# EAGLE design MainBoard (EAGLE 8.3.1)
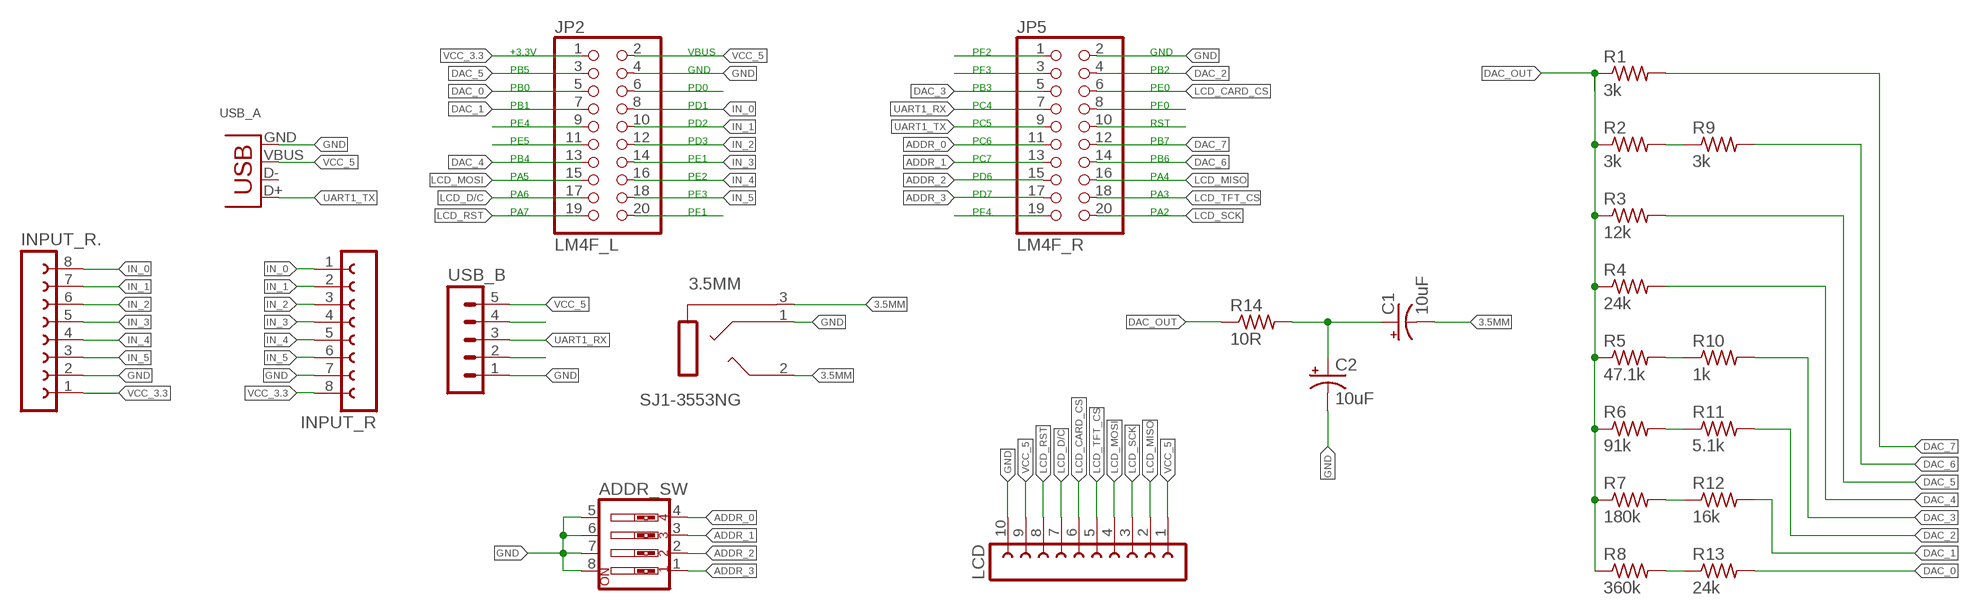
[diagram p0: schematic, sheet 1]

## Parts
3.5MM  SJ1-3553NG  [SJ1-3553NG]
ADDR_SW  SW_DIP-4  [EDG-04]
C1  10uF  CPOL-USE2-4  [E2-4]
C2  10uF  CPOL-USE2-4  [E2-4]
INPUT_R  FE08W  [FE08W]
INPUT_R.  FE08W  [FE08W]
JP2  LM4F_L  PINHD-2X10  [2X10]
JP5  LM4F_R  PINHD-2X10  [2X10]
LCD  FE10-1  [FE10]
R1  3k  R-US_0309/10  [0309/10]
R2  3k  R-US_0309/10  [0309/10]
R3  12k  R-US_0309/10  [0309/10]
R4  24k  R-US_0309/10  [0309/10]
R5  47.1k  R-US_0309/10  [0309/10]
R6  91k  R-US_0309/10  [0309/10]
R7  180k  R-US_0309/10  [0309/10]
R8  360k  R-US_0309/10  [0309/10]
R9  3k  R-US_0309/10  [0309/10]
R10  1k  R-US_0309/10  [0309/10]
R11  5.1k  R-US_0309/10  [0309/10]
R12  16k  R-US_0309/10  [0309/10]
R13  24k  R-US_0309/10  [0309/10]
R14  10R  R-US_0309/10  [0309/10]
USB_A  USB-A-H  [USB-A-H]
USB_B  MA05-1  [MA05-1]

## Nets
3.5MM: 3.5MM.2(TIP) 3.5MM.3(SLEEVE) C1.-
ADDR_0: ADDR_SW.4 JP5.11
ADDR_1: ADDR_SW.3 JP5.13
ADDR_2: ADDR_SW.2 JP5.15
ADDR_3: ADDR_SW.1 JP5.17
DAC_0: JP2.5 R13.2
DAC_1: JP2.7 R12.2
DAC_2: JP5.4 R11.2
DAC_3: JP5.5 R10.2
DAC_4: JP2.13 R4.2
DAC_5: JP2.3 R3.2
DAC_6: JP5.14 R9.2
DAC_7: JP5.12 R1.2
DAC_OUT: R1.1 R2.1 R3.1 R4.1 R5.1 R6.1 R7.1 R8.1 R14.1
GND: 3.5MM.1(RING) ADDR_SW.5 ADDR_SW.6 ADDR_SW.7 ADDR_SW.8 C2.- INPUT_R.7 INPUT_R..2 JP2.4 JP5.2 LCD.10 USB_A.GND USB_B.1
IN_0: INPUT_R.1 INPUT_R..8 JP2.8
IN_1: INPUT_R.2 INPUT_R..7 JP2.10
IN_2: INPUT_R.3 INPUT_R..6 JP2.12
IN_3: INPUT_R.4 INPUT_R..5 JP2.14
IN_4: INPUT_R.5 INPUT_R..4 JP2.16
IN_5: INPUT_R.6 INPUT_R..3 JP2.18
LCD_CARD_CS: JP5.6 LCD.6
LCD_D/C: JP2.17 LCD.7
LCD_MISO: JP5.16 LCD.2
LCD_MOSI: JP2.15 LCD.4
LCD_RST: JP2.19 LCD.8
LCD_SCK: JP5.20 LCD.3
LCD_TFT_CS: JP5.18 LCD.5
N$1: C1.+ C2.+ R14.2
N$2: R7.2 R12.1
N$3: R8.2 R13.1
N$5: R2.2 R9.1
N$6: R5.2 R10.1
N$7: R6.2 R11.1
N$11: USB_B.2
N$13: USB_B.4
PD0: JP2.6
PE4: JP2.9
PE5: JP2.11
PF0: JP5.8
PF1: JP2.20
PF2: JP5.1
PF3: JP5.3
PF4: JP5.19
RST: JP5.10
UART1_RX: JP5.7 USB_B.3
UART1_TX: JP5.9 USB_A.D+
VCC_3.3: INPUT_R.8 INPUT_R..1 JP2.1
VCC_5: JP2.2 LCD.1 LCD.9 USB_A.VBUS USB_B.5
Unconnected: USB_A.D-

## Notes on the sheet
- +3.3V | VBUS | PF2 | GND
- PB5 | GND | PF3 | PB2
- PB0 | PD0 | PB3 | PE0
- PB1 | PD1 | PC4 | PF0
- PE4 | PD2 | PC5 | RST
- PE5 | PD3 | PC6 | PB7
- PB4 | PE1 | PC7 | PB6
- PA5 | PE2 | PD6 | PA4
- PA6 | PE3 | PD7 | PA3
- PA7 | PF1 | PF4 | PA2

## Library data of the parts
3.5MM = SJ1-3553NG:SJ1-3553NG: STEREO JACK - 3.5mm; DESCRIPTION: SJ1 Series 3.5 mm 12 V Right Angle Through Hole Isolated Stereo Audio Jack; DIGI-KEY_PART_NUMBER: CP1-3553NG-ND; DIGI-KEY_PURCHASE_URL: https://www.digikey.com/product-detail/en/cui-inc/SJ1-3553NG/CP1-3553NG-ND/738710?WT.z_cid=ref_snapeda&utm_source=snapeda&utm_medium=aggregator&utm_campaign=buynow; MF: CUI; MP: SJ1-3553NG; PACKAGE: None
ADDR_SW = special:SW_DIP-4: DIP SWITCH
C1 C2 = rcl:CPOL-US: POLARIZED CAPACITOR, American symbol; SPICEPREFIX: C
INPUT_R INPUT_R. = con-lsta:FE08W: FEMALE HEADER; OC_FARNELL: unknown; OC_NEWARK: unknown
JP2 JP5 = pinhead:PINHD-2X10: PIN HEADER
LCD = con-lsta:FE10-1: FEMALE HEADER; OC_FARNELL: unknown; OC_NEWARK: unknown
R1-R14 = rcl:R-US_: RESISTOR, American symbol
USB_A = con-usb-3:USB: USB Connectors
USB_B = con-lstb:MA05-1: PIN HEADER; OC_FARNELL: unknown; OC_NEWARK: unknown

## Net classes
1 Power: width 0.508 mm, clearance 0.381 mm

## Board
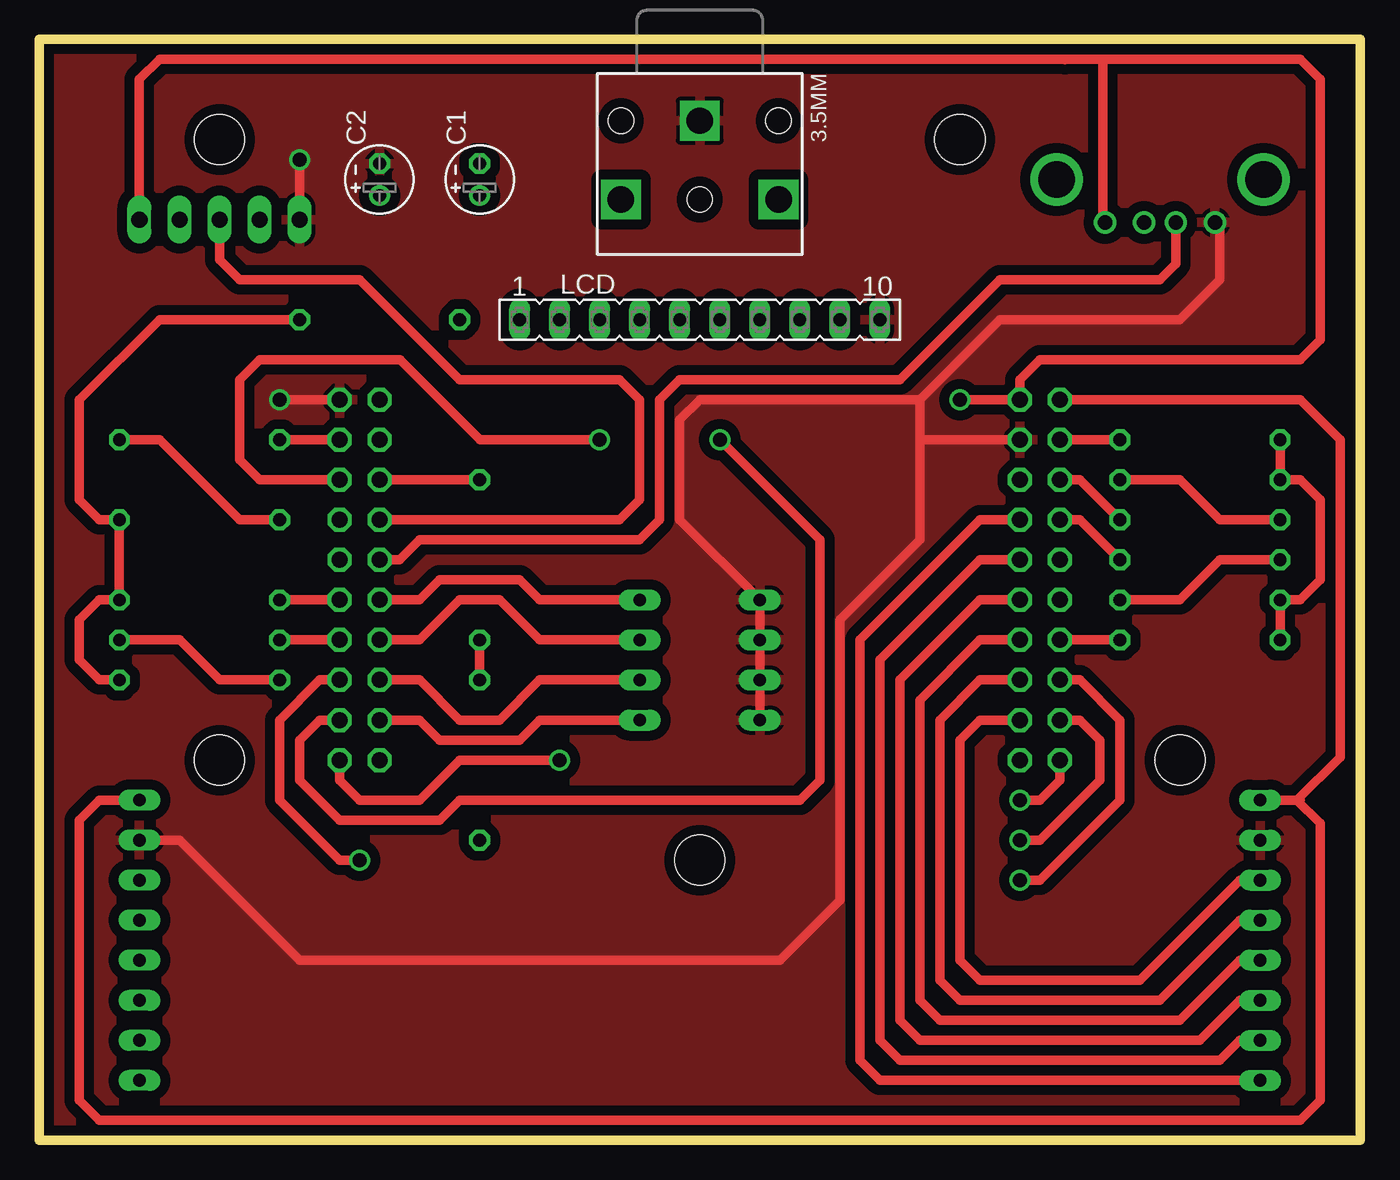
[diagram p1: board, top side]
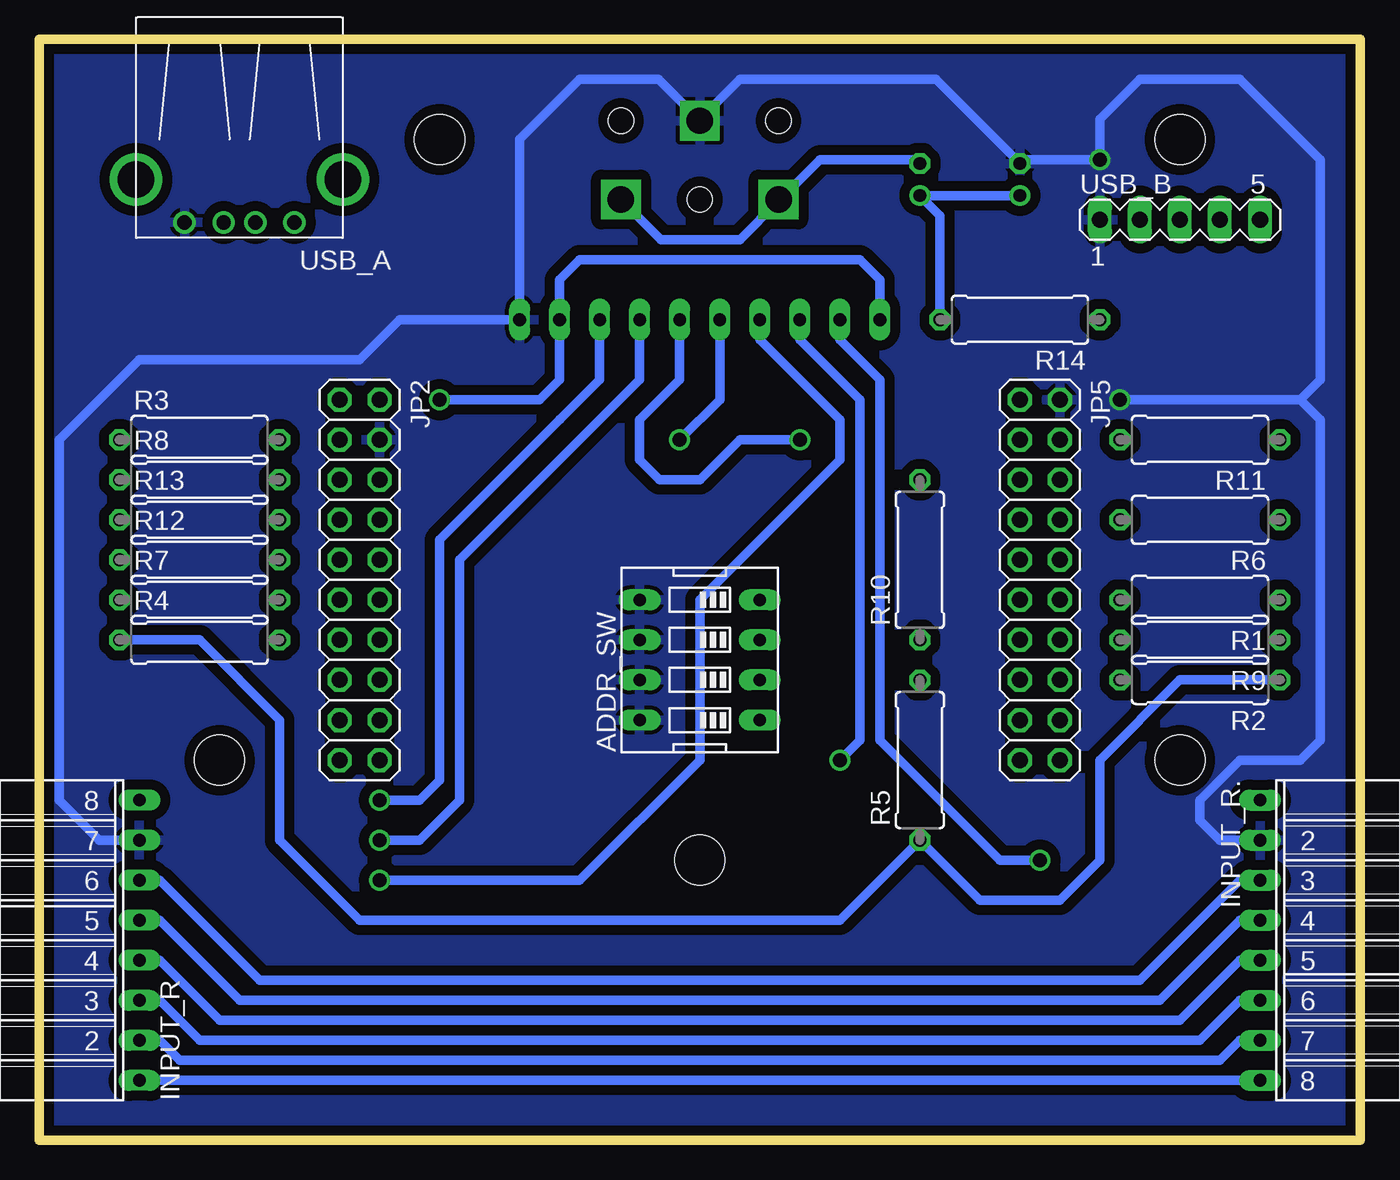
[diagram p2: board, bottom side, seen from below]

Size 83.82 x 69.85 mm. Coordinates in mm from the lower left corner, seen from the top.
Outline: 0,0 83.82,0 83.82,69.85 0,69.85 0,0
Copper layers (1*16): Top 0.035mm / dielectric 1.5mm / Bottom 0.035mm
Design rules "default *": minimum track width 6mil, minimum drill 0.35mm, track to track 10mil, track to pad 12mil, pad to pad 6mil, via to via 15mil, smd to smd 6mil, copper to edge 10mil, drill to drill 10mil, minimum pad ring 10mil, minimum via ring 8mil, stop-mask expansion 4mil, vias tented up to drill 0mil, thermal gap 10mil
Holes 3.17 mm at 11.43,63.5 58.42,63.5 72.39,24.13 41.91,17.78 11.43,24.13

### Footprints (pad centres in the part's own frame; a part is rotated, then mirrored left to right if it is on the bottom)
SJ1-3553NG = drill 1.676 square: 1 -5,0; 2 0,-5; 3 0,5 | hole 1.6: -5,-5; -5,5; 0,0
EDG-04 = drill 0.813 long: 1 -3.81,-3.81; 2 -1.27,-3.81; 3 1.27,-3.81; 4 3.81,-3.81; 5 3.81,3.81; 6 1.27,3.81; 7 -1.27,3.81; 8 -3.81,3.81
E2-4 = drill 0.813 pad 1.27: + -1.016,0 | drill 0.813 pad 1.27 octagon: - 1.016,0
FE08W = drill 0.813 long: 1 -8.89,0; 2 -6.35,0; 3 -3.81,0; 4 -1.27,0; 5 1.27,0; 6 3.81,0; 7 6.35,0; 8 8.89,0
2X10 = drill 1.016 octagon: 1 -11.43,-1.27; 2 -11.43,1.27; 3 -8.89,-1.27; 4 -8.89,1.27; 5 -6.35,-1.27; 6 -6.35,1.27; 7 -3.81,-1.27; 8 -3.81,1.27; 9 -1.27,-1.27; 10 -1.27,1.27; 11 1.27,-1.27; 12 1.27,1.27; 13 3.81,-1.27; 14 3.81,1.27; 15 6.35,-1.27; 16 6.35,1.27; 17 8.89,-1.27; 18 8.89,1.27; 19 11.43,-1.27; 20 11.43,1.27
FE10 = drill 0.813 long: 1 -11.43,0; 2 -8.89,0; 3 -6.35,0; 4 -3.81,0; 5 -1.27,0; 6 1.27,0; 7 3.81,0; 8 6.35,0; 9 8.89,0; 10 11.43,0
0309/10 = drill 0.813 octagon: 1 -5.08,0; 2 5.08,0
USB-A-H = drill 0.914: D+ 2.718,-1.003; D- 2.718,1.003; GND 2.718,-3.493; VBUS 2.718,3.493 | drill 2.311: P$5 0,-6.566; P$6 0,6.566
MA05-1 = drill 1.016 long: 1 -5.08,0; 2 -2.54,0; 3 0,0; 4 2.54,0; 5 5.08,0

### Placement (x,y rotation side)
3.5MM  41.91,59.69 270 top
ADDR_SW  41.91,30.48 90 bottom
C1  27.94,60.96 90 top
C2  21.59,60.96 90 top
INPUT_R  77.47,12.7 90 bottom
INPUT_R.  6.35,12.7 270 bottom
JP2  63.5,35.56 270 bottom
JP5  20.32,35.56 270 bottom
LCD  41.91,52.07 0 top
R1  10.16,34.29 180 bottom
R2  10.16,29.21 180 bottom
R3  73.66,44.45 0 bottom
R4  73.66,31.75 0 bottom
R5  27.94,24.13 90 bottom
R6  10.16,39.37 180 bottom
R7  73.66,34.29 0 bottom
R8  73.66,41.91 0 bottom
R9  10.16,31.75 180 bottom
R10  27.94,36.83 90 bottom
R11  10.16,44.45 180 bottom
R12  73.66,36.83 0 bottom
R13  73.66,39.37 0 bottom
R14  21.59,52.07 180 bottom
USB_A  71.12,60.96 270 bottom
USB_B  11.43,58.42 0 bottom

### Tracks (layer width: path | path; a pad name or v marks a point on that pad's centre or on a via)
3.5MM
  Bottom 0.61: 3.5MM.3 44.37,57.15 39.37,57.15 36.91,59.61 3.5MM.2 36.83,59.69 34.29,62.23 28.19,62.23 C1.-
ADDR_0
  Top 0.61: JP5.11 24.13,34.29 25.4,35.56 30.48,35.56 31.75,34.29 ADDR_SW.4
ADDR_1
  Top 0.61: JP5.13 24.13,31.75 26.67,34.29 29.21,34.29 31.75,31.75 ADDR_SW.3
ADDR_2
  Top 0.61: ADDR_SW.2 34.34,29.21 34.29,29.21 31.75,29.21 29.21,26.67 26.67,26.67 24.13,29.21 JP5.15
ADDR_3
  Top 0.61: 22.86,26.67 JP5.17 24.13,26.67 25.4,25.4 30.48,25.4 31.75,26.67 ADDR_SW.1
DAC_0
  Top 0.61: JP2.5 66.04,41.91 R13.2
DAC_1
  Top 0.61: R12.2 66.04,39.37 JP2.7
DAC_2
  Top 0.61: R11.2 JP5.4
DAC_3
  Top 0.61: JP5.5 R10.2
DAC_4
  Top 0.61: R4.2 JP2.13
DAC_5
  Top 0.61: JP2.3 R3.2
DAC_6
  Top 0.61: R9.2 JP5.14
DAC_7
  Top 0.61: R1.2 JP5.12
DAC_OUT
  Top 0.61: R2.1 3.81,29.21 2.54,30.48 2.54,33.02 3.81,34.29 R1.1 R6.1 3.81,39.37 2.54,40.64 2.54,46.99 7.62,52.07 R14.1 | R3.1 R8.1 80.01,41.91 81.28,40.64 81.28,35.56 80.01,34.29 R7.1 R4.1
  Bottom 0.61: R2.1 11.43,29.21 16.51,24.13 16.51,17.78 19.05,15.24 24.13,15.24 R5.1 33.02,13.97 63.5,13.97 68.58,19.05 68.58,26.67 73.66,31.75 R4.1
GND  (via drill 0.89)
  Top 0.61: INPUT_R..2 8.89,19.05 16.51,11.43 46.99,11.43 50.8,15.24 50.8,33.02 55.88,38.1 55.88,44.45 | 55.88,46.99 55.88,44.45 | ADDR_SW.8 ADDR_SW.7 ADDR_SW.6 ADDR_SW.5 40.64,39.37 40.64,45.72 41.91,46.99 55.88,46.99 | USB_A.GND 74.93,57.92 74.93,54.61 72.39,52.07 60.96,52.07 55.88,46.99 | USB_B.1 v16.51,62.23 | JP5.2 v15.24,46.99 | JP2.4 55.88,44.45
  Bottom 0.61: INPUT_R.7 80.01,19.05 82.55,21.59 82.55,44.45 77.47,49.53 63.5,49.53 60.96,52.07 LCD.10 53.34,63.5 49.53,67.31 44.53,67.31 3.5MM.1 41.91,64.77 39.37,67.31 26.92,67.31 21.79,62.18 | 21.79,62.18 C2.- 21.34,62.23 | 21.34,62.23 21.74,62.23 21.79,62.18 | 21.34,62.23 v16.51,62.23 16.51,64.77 13.97,67.31 7.62,67.31 2.54,62.23 2.54,48.26 3.81,46.99 | 3.81,46.99 v15.24,46.99 | INPUT_R..2 8.89,19.05 10.16,20.32 10.16,21.59 7.62,24.13 3.81,24.13 2.54,25.4 2.54,45.72 3.81,46.99
  pour Top (isolate 0.635): 0,0 83.82,0 83.82,69.85 0,69.85
  pour Bottom (isolate 0.635): 0,69.85 0,0 83.82,0 83.82,69.85
IN_0
  Top 0.61: INPUT_R.1 53.34,3.81 52.07,5.08 52.07,31.75 59.69,39.37 JP2.8
  Bottom 0.61: INPUT_R..8 INPUT_R.1
IN_1
  Top 0.61: JP2.10 59.69,36.83 53.34,30.48 53.34,6.35 54.61,5.08 74.93,5.08 76.2,6.35 INPUT_R.2
  Bottom 0.61: INPUT_R.2 76.2,6.35 74.93,5.08 8.89,5.08 7.62,6.35 INPUT_R..7
IN_2
  Top 0.61: INPUT_R.3 76.2,8.89 73.66,6.35 55.88,6.35 54.61,7.62 54.61,29.21 59.69,34.29 JP2.12
  Bottom 0.61: INPUT_R..6 7.62,8.89 10.16,6.35 73.66,6.35 76.2,8.89 INPUT_R.3
IN_3
  Top 0.61: JP2.14 59.69,31.75 55.88,27.94 55.88,8.89 57.15,7.62 72.39,7.62 76.2,11.43 INPUT_R.4
  Bottom 0.61: INPUT_R.4 76.2,11.43 72.39,7.62 11.43,7.62 7.62,11.43 INPUT_R..5
IN_4
  Top 0.61: INPUT_R.5 76.2,13.97 71.12,8.89 58.42,8.89 57.15,10.16 57.15,26.67 59.69,29.21 JP2.16
  Bottom 0.61: INPUT_R..4 7.62,13.97 12.7,8.89 71.12,8.89 76.2,13.97 INPUT_R.5
IN_5
  Top 0.61: JP2.18 59.69,26.67 58.42,25.4 58.42,11.43 59.69,10.16 69.85,10.16 76.2,16.51 INPUT_R.6
  Bottom 0.61: INPUT_R.6 76.2,16.51 69.85,10.16 13.97,10.16 7.62,16.51 INPUT_R..3
LCD_CARD_CS  (via drill 0.89)
  Top 0.61: JP5.6 13.97,41.91 12.7,43.18 12.7,48.26 13.97,49.53 22.89,49.53 27.97,44.45 v35.56,44.45
  Bottom 0.61: v35.56,44.45 39.37,44.45 41.91,41.91 44.45,41.91 45.72,43.18 45.72,45.72 43.18,48.26 LCD.6
LCD_D/C  (via drill 0.89)
  Top 0.61: JP2.17 66.04,26.67 67.31,25.4 67.31,22.86 63.5,19.05 v62.23,19.05
  Bottom 0.61: v62.23,19.05 59.69,19.05 57.15,21.59 57.15,36.83 45.72,48.26 LCD.7
LCD_MISO  (via drill 0.89)
  Top 0.61: JP5.16 17.78,29.21 15.24,26.67 15.24,21.59 19.05,17.78 v20.32,17.78
  Bottom 0.61: v20.32,17.78 22.86,17.78 30.48,25.4 30.48,48.26 33.02,50.8 LCD.2
LCD_MOSI  (via drill 0.89)
  Top 0.61: JP2.15 66.04,29.21 68.58,26.67 68.58,21.59 63.5,16.51 v62.23,16.51
  Bottom 0.61: LCD.4 38.1,50.8 33.02,45.72 33.02,43.18 41.91,34.29 41.91,24.13 49.53,16.51 v62.23,16.51
LCD_RST  (via drill 0.89)
  Top 0.61: JP2.19 64.77,22.86 63.5,21.59 v62.23,21.59
  Bottom 0.61: v62.23,21.59 59.69,21.59 58.42,22.86 58.42,38.1 50.77,45.75 | LCD.8 48.26,48.26 50.77,45.75 | 50.77,45.75 50.8,45.72
LCD_SCK  (via drill 0.89)
  Top 0.61: JP5.20 19.05,22.86 20.32,21.59 24.13,21.59 26.67,24.13 v33.02,24.13
  Bottom 0.61: LCD.3 35.56,50.8 31.75,46.99 31.75,25.4 v33.02,24.13
LCD_TFT_CS  (via drill 0.89)
  Top 0.61: JP5.18 17.78,26.67 16.51,25.4 16.51,22.86 19.05,20.32 25.4,20.32 26.67,21.59 48.26,21.59 49.53,22.86 49.53,38.1 v43.18,44.45
  Bottom 0.61: LCD.5 40.64,46.99 v43.18,44.45
N$1
  Bottom 0.61: R14.2 26.67,58.67 C1.+ C2.+
N$2
  Top 0.61: R7.2 72.39,34.29 74.93,36.83 R12.1
N$3
  Top 0.61: R8.2 72.39,41.91 74.93,39.37 R13.1
N$5
  Top 0.61: R9.1 8.89,31.75 11.43,29.21 R2.2
N$6
  Top 0.61: R10.1 R5.2
N$7
  Top 0.61: R11.1 7.62,44.45 12.7,39.37 R6.2
UART1_RX
  Top 0.61: JP5.7 36.83,39.37 38.1,40.64 38.1,46.99 36.83,48.26 26.67,48.26 20.32,54.61 12.7,54.61 11.43,55.88 USB_B.3
UART1_TX
  Top 0.61: JP5.9 22.86,36.83 24.13,38.1 38.1,38.1 39.37,39.37 39.37,46.99 40.64,48.26 54.61,48.26 60.96,54.61 71.12,54.61 72.12,55.61 USB_A.D+
VCC_3.3
  Top 0.61: INPUT_R..1 3.81,21.59 2.54,20.32 2.54,2.54 3.81,1.27 80.01,1.27 81.28,2.54 81.28,20.13 79.82,21.59 | 79.82,21.59 80.01,21.59 | 79.82,21.59 INPUT_R.8 | JP2.1 80.01,46.99 82.55,44.45 82.55,24.32 79.82,21.59
VCC_5  (via drill 0.89)
  Top 0.61: v58.42,46.99 JP2.2 62.23,48.26 63.5,49.53 80.01,49.53 81.28,50.8 81.28,67.31 80.01,68.58 67.51,68.58 | 67.51,68.58 65.1,68.58 65.09,68.56 65.07,68.58 7.62,68.58 6.35,67.31 USB_B.5 | USB_A.VBUS 67.51,58.36 67.51,68.58
  Bottom 0.61: LCD.1 30.48,54.61 31.75,55.88 49.53,55.88 50.8,54.61 LCD.9 50.8,48.26 52.07,46.99 v58.42,46.99